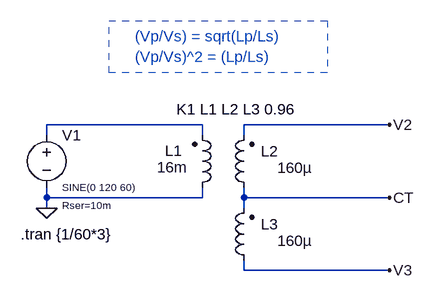
[diagram p0: schematic Trafos.asc]
Trafos.asc, the LTspice schematic file:
Version 4
SHEET 1 880 680
WIRE 96 96 -144 96
WIRE 384 96 160 96
WIRE -144 112 -144 96
WIRE 96 112 96 96
WIRE 160 112 160 96
WIRE -144 208 -144 192
WIRE 96 208 96 192
WIRE 96 208 -144 208
WIRE 160 208 160 192
WIRE 384 208 160 208
WIRE -144 224 -144 208
WIRE 160 224 160 208
WIRE 160 320 160 304
WIRE 384 320 160 320
FLAG 384 96 V2
FLAG -144 224 0
FLAG 384 320 V3
FLAG 384 208 CT
SYMBOL ind2 80 208 M180
WINDOW 0 -42 72 Left 2
WINDOW 3 -54 47 Left 2
SYMATTR InstName L1
SYMATTR Value 16m
SYMATTR Type ind
SYMBOL ind2 176 208 R180
WINDOW 0 -37 71 Left 2
WINDOW 3 -89 46 Left 2
SYMATTR InstName L2
SYMATTR Value 160µ
SYMATTR Type ind
SYMBOL voltage -144 96 R0
WINDOW 3 24 96 Left 1
WINDOW 123 0 0 Left 0
WINDOW 39 24 124 Left 1
SYMATTR Value SINE(0 120 60)
SYMATTR SpiceLine Rser=10m
SYMATTR InstName V1
SYMBOL ind2 176 320 R180
WINDOW 0 -37 71 Left 2
WINDOW 3 -89 46 Left 2
SYMATTR InstName L3
SYMATTR Value 160µ
SYMATTR Type ind
TEXT 56 72 Left 2 !K1 L1 L2 L3 0.96
TEXT -184 264 Left 2 !.tran {1/60*3}
TEXT -8 -40 Left 2 ;(Vp/Vs) = sqrt(Lp/Ls)\n(Vp/Vs)^2 = (Lp/Ls)
RECTANGLE Normal 288 16 -48 -64 2

The netlist it stands for:
* Trafos.asc
L1 0 N001 16m
L2 CT V2 160µ
V1 N001 0 SINE(0 120 60) Rser=10m
L3 V3 CT 160µ
K1 L1 L2 L3 0.96
.tran {1/60*3}
* (Vp/Vs) = sqrt(Lp/Ls)
* (Vp/Vs)^2 = (Lp/Ls)
.backanno
.end